# EAGLE design TSC8-75pld (EAGLE 6.6.0)
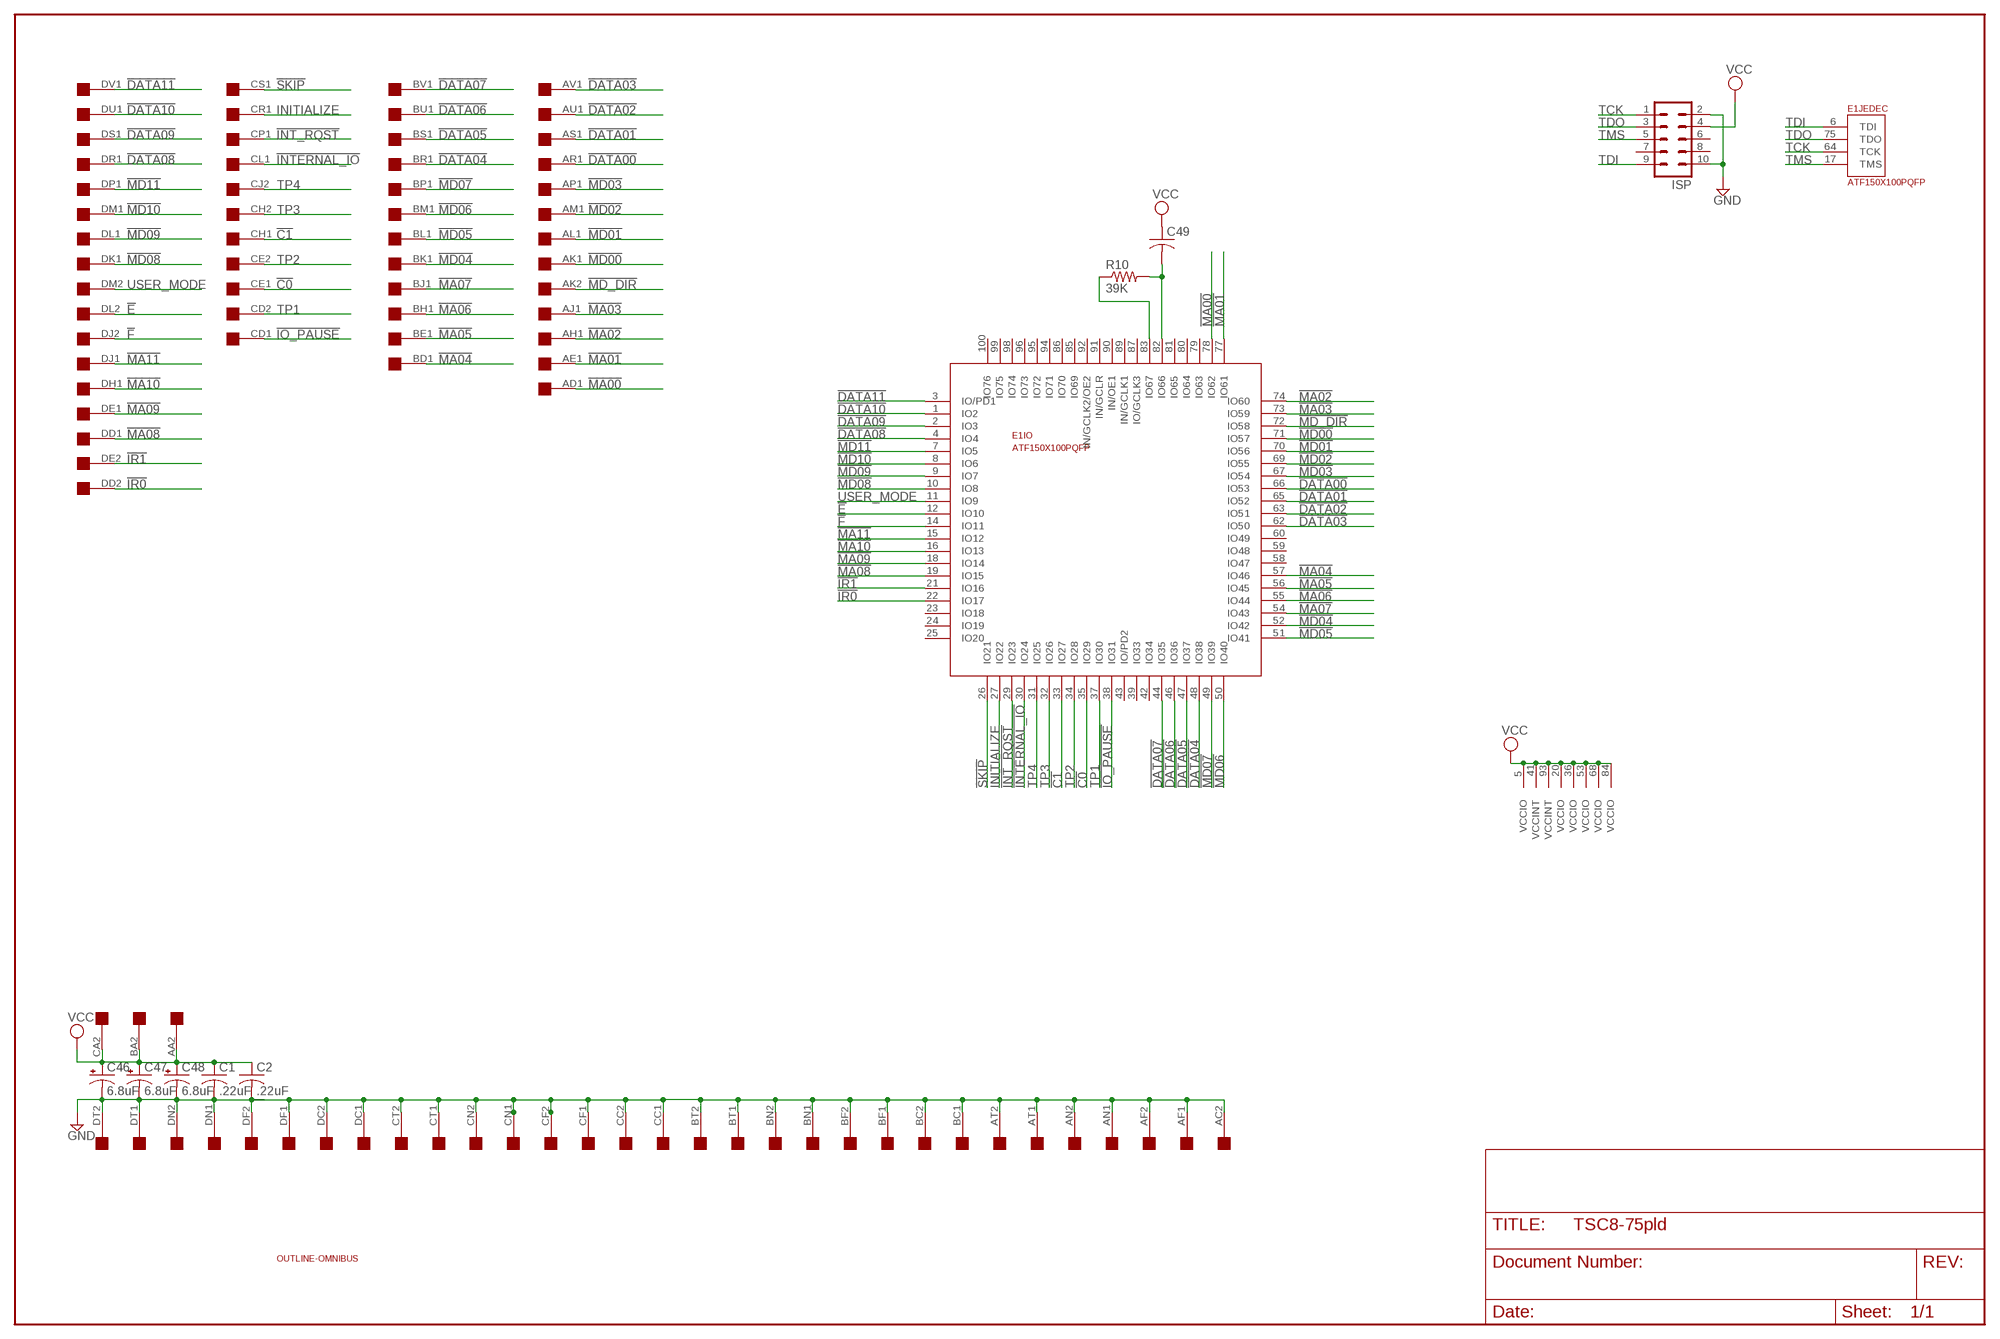
[diagram p0: schematic, sheet 1]

## Parts
C1  .22uF  C-US050-025X075  [C050-025X075]
C2  .22uF  C-US050-025X075  [C050-025X075]
C46  6.8uF  CPOL-USE20-8AXIAL  [E12-8]
C47  6.8uF  CPOL-USE20-8AXIAL  [E12-8]
C48  6.8uF  CPOL-USE20-8AXIAL  [E12-8]
C49  C-US050-025X075  [C050-025X075]
E1  ATF150X100PQFP  [PQFP-100]
EDGE  QUAD  [EDGE-CON8]
ISP  ML10  [ML10]
R10  39K  R-US_0204/7  [0204/7]
U$1  OUTLINE-OMNIBUS  [OMNIBUS]

## Nets
!C0: E1.35(IO:IO29) EDGE.CE1
!C1: E1.33(IO:IO27) EDGE.CH1
!DATA00: E1.66(IO:IO53) EDGE.AR1
!DATA01: E1.65(IO:IO52) EDGE.AS1
!DATA02: E1.63(IO:IO51) EDGE.AU1
!DATA03: E1.62(IO:IO50) EDGE.AV1
!DATA04: E1.48(IO:IO38) EDGE.BR1
!DATA05: E1.47(IO:IO37) EDGE.BS1
!DATA06: E1.46(IO:IO36) EDGE.BU1
!DATA07: E1.44(IO:IO35) EDGE.BV1
!DATA08: E1.4(IO:IO4) EDGE.DR1
!DATA09: E1.2(IO:IO3) EDGE.DS1
!DATA10: E1.1(IO:IO2) EDGE.DU1
!DATA11: E1.3(IO:IO/PD1) EDGE.DV1
!E: E1.12(IO:IO10) EDGE.DL2
!F: E1.14(IO:IO11) EDGE.DJ2
!INT_RQST: E1.29(IO:IO23) EDGE.CP1
!INTERNAL_IO: E1.30(IO:IO24) EDGE.CL1
!IO_PAUSE: E1.38(IO:IO31) EDGE.CD1
!IR0: E1.22(IO:IO17) EDGE.DD2
!IR1: E1.21(IO:IO16) EDGE.DE2
!MA00: E1.78(IO:IO62) EDGE.AD1
!MA01: E1.77(IO:IO61) EDGE.AE1
!MA02: E1.74(IO:IO60) EDGE.AH1
!MA03: E1.73(IO:IO59) EDGE.AJ1
!MA04: E1.57(IO:IO46) EDGE.BD1
!MA05: E1.56(IO:IO45) EDGE.BE1
!MA06: E1.55(IO:IO44) EDGE.BH1
!MA07: E1.54(IO:IO43) EDGE.BJ1
!MA08: E1.19(IO:IO15) EDGE.DD1
!MA09: E1.18(IO:IO14) EDGE.DE1
!MA10: E1.16(IO:IO13) EDGE.DH1
!MA11: E1.15(IO:IO12) EDGE.DJ1
!MD00: E1.71(IO:IO57) EDGE.AK1
!MD01: E1.70(IO:IO56) EDGE.AL1
!MD02: E1.69(IO:IO55) EDGE.AM1
!MD03: E1.67(IO:IO54) EDGE.AP1
!MD04: E1.52(IO:IO42) EDGE.BK1
!MD05: E1.51(IO:IO41) EDGE.BL1
!MD06: E1.50(IO:IO40) EDGE.BM1
!MD07: E1.49(IO:IO39) EDGE.BP1
!MD08: E1.10(IO:IO8) EDGE.DK1
!MD09: E1.9(IO:IO7) EDGE.DL1
!MD10: E1.8(IO:IO6) EDGE.DM1
!MD11: E1.7(IO:IO5) EDGE.DP1
!MD_DIR: E1.72(IO:IO58) EDGE.AK2
!SKIP: E1.26(IO:IO21) EDGE.CS1
GND: C1.2 C2.2 C46.- C47.- C48.- EDGE.AC2 EDGE.AF1 EDGE.AF2 EDGE.AN1 EDGE.AN2 EDGE.AT1 EDGE.AT2 EDGE.BC1 EDGE.BC2 EDGE.BF1 EDGE.BF2 EDGE.BN1 EDGE.BN2 EDGE.BT1 EDGE.BT2 EDGE.CC1 EDGE.CC2 EDGE.CF1 EDGE.CF2 EDGE.CN1 EDGE.CN2 EDGE.CT1 EDGE.CT2 EDGE.DC1 EDGE.DC2 EDGE.DF1 EDGE.DF2 EDGE.DN1 EDGE.DN2 EDGE.DT1 EDGE.DT2 ISP.2 ISP.10
INITIALIZE: E1.27(IO:IO22) EDGE.CR1
N$63: E1.83(IO:IO67) R10.1
N$558: C49.2 E1.82(IO:IO66) R10.2
TCK: E1.64(JEDEC:TCK) ISP.1
TDI: E1.6(JEDEC:TDI) ISP.9
TDO: E1.75(JEDEC:TDO) ISP.3
TMS: E1.17(JEDEC:TMS) ISP.5
TP1: E1.37(IO:IO30) EDGE.CD2
TP2: E1.34(IO:IO28) EDGE.CE2
TP3: E1.32(IO:IO26) EDGE.CH2
TP4: E1.31(IO:IO25) EDGE.CJ2
USER_MODE: E1.11(IO:IO9) EDGE.DM2
VCC: C1.1 C2.1 C46.+ C47.+ C48.+ C49.1 E1.5(VCCIO) E1.20(VCCIO) E1.36(VCCIO) E1.41(VCCINT) E1.53(VCCIO) E1.68(VCCIO) E1.84(VCCIO) E1.93(VCCINT) EDGE.AA2 EDGE.BA2 EDGE.CA2 ISP.4
Unconnected: E1.23(IO:IO18) E1.24(IO:IO19) E1.25(IO:IO20) E1.39(IO:IO33) E1.42(IO:IO34) E1.43(IO:IO/PD2) E1.58(IO:IO47) E1.59(IO:IO48) E1.60(IO:IO49) E1.79(IO:IO63) E1.80(IO:IO64) E1.81(IO:IO65) E1.85(IO:IO69) E1.86(IO:IO70) E1.87(IO:IO/GCLK3) E1.89(IO:IN/GCLK1) E1.90(IO:IN/OE1) E1.91(IO:IN/GCLR) E1.92(IO:IN/GCLK2/OE2) E1.94(IO:IO71) E1.95(IO:IO72) E1.96(IO:IO73) E1.98(IO:IO74) E1.99(IO:IO75) E1.100(IO:IO76) EDGE.AA1 EDGE.AB1 EDGE.AB2 EDGE.AC1 EDGE.AD2 EDGE.AE2 EDGE.AH2 EDGE.AJ2 EDGE.AL2 EDGE.AM2 EDGE.AP2 EDGE.AR2 EDGE.AS2 EDGE.AU2 EDGE.AV2 EDGE.BA1 EDGE.BB1 EDGE.BB2 EDGE.BD2 EDGE.BE2 EDGE.BH2 EDGE.BJ2 EDGE.BK2 EDGE.BL2 EDGE.BM2 EDGE.BP2 EDGE.BR2 EDGE.BS2 EDGE.BU2 EDGE.BV2 EDGE.CA1 EDGE.CB1 EDGE.CB2 EDGE.CJ1 EDGE.CK1 EDGE.CK2 EDGE.CL2 EDGE.CM1 EDGE.CM2 EDGE.CP2 EDGE.CR2 EDGE.CS2 EDGE.CU1 EDGE.CU2 EDGE.CV1 EDGE.CV2 EDGE.DA1 EDGE.DA2 EDGE.DB1 EDGE.DB2 EDGE.DH2 EDGE.DK2 EDGE.DP2 EDGE.DR2 EDGE.DS2 EDGE.DU2 EDGE.DV2 ISP.6 ISP.7 ISP.8

## Power pins joined to a net without a drawn wire
GND: E1.13(GND) E1.28(GND) E1.40(GND) E1.45(GND) E1.61(GND) E1.76(GND) E1.88(GND) E1.97(GND)

## Library data of the parts
C1 C2 C49 = rcl:C-US: CAPACITOR, American symbol
C46-C48 = dec-con:CPOL-USE20-8AXIAL: A 0.8 inch electrolytic.
E1 = atmel-cpld:ATF150X100: ATF150x in 100 pin package.
EDGE = dec-con:QUAD: Quad-Height DEC board
ISP = con-harting-ml:ML10: HARTING
R10 = rcl:R-US_: RESISTOR, American symbol
U$1 = dec-con:OUTLINE-*: Board outlines for DEC boards.

## Net classes
0 default: width 0.305 mm

## Board
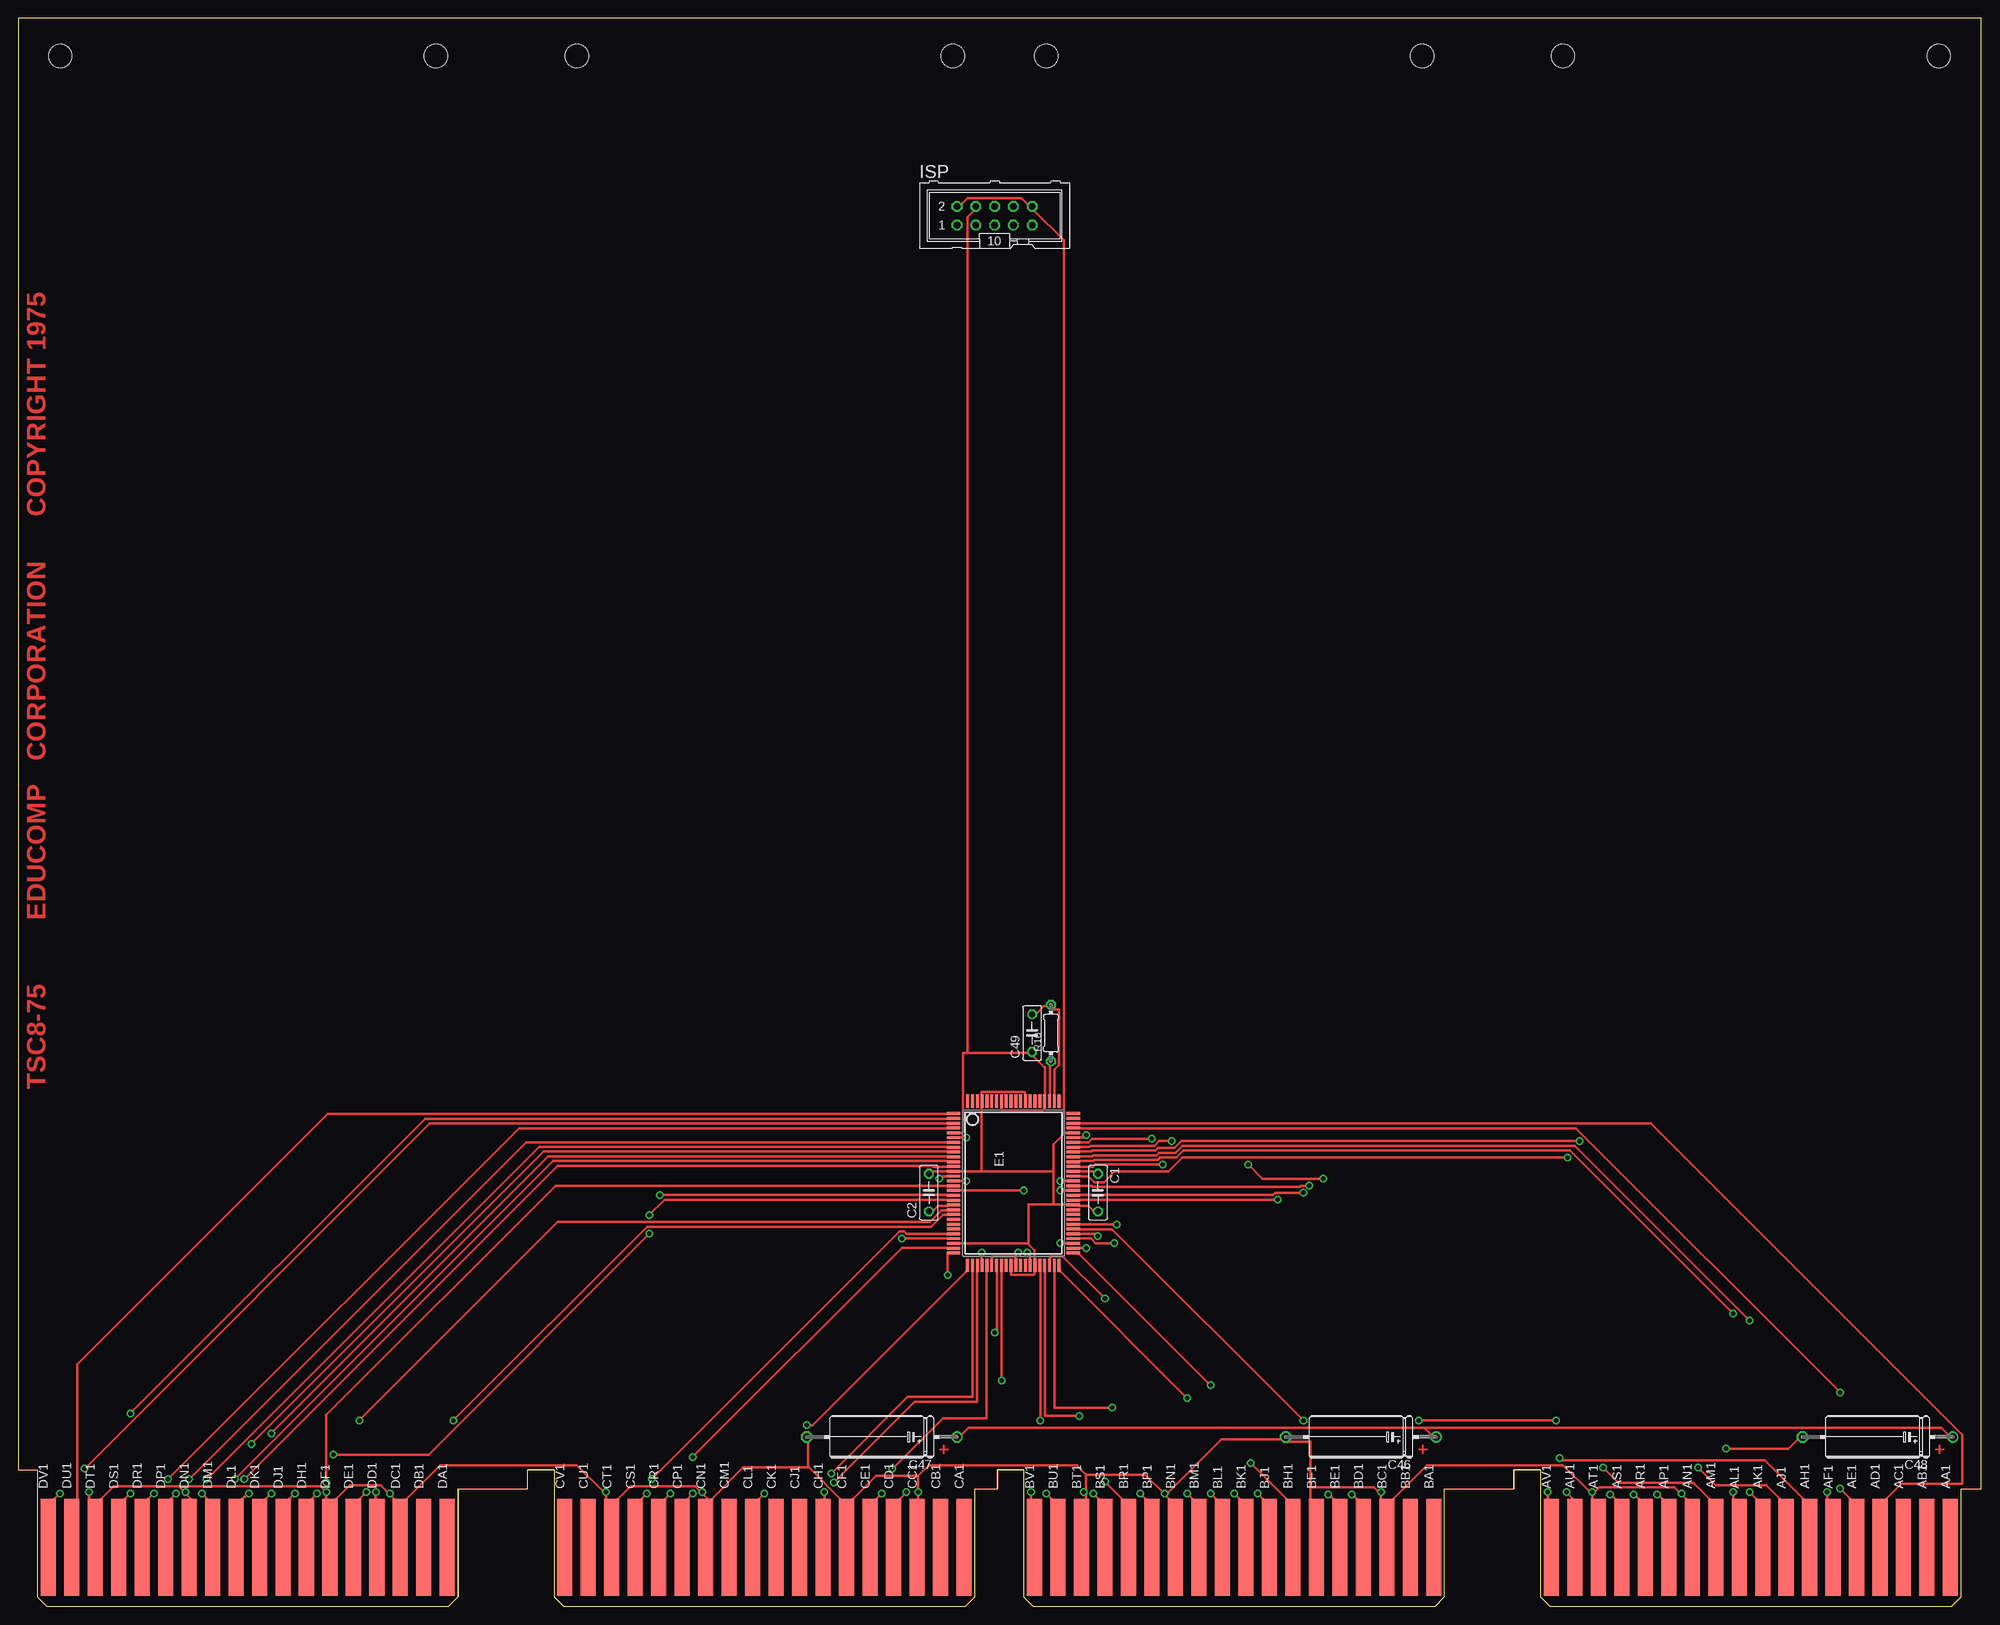
[diagram p1: board, top side]
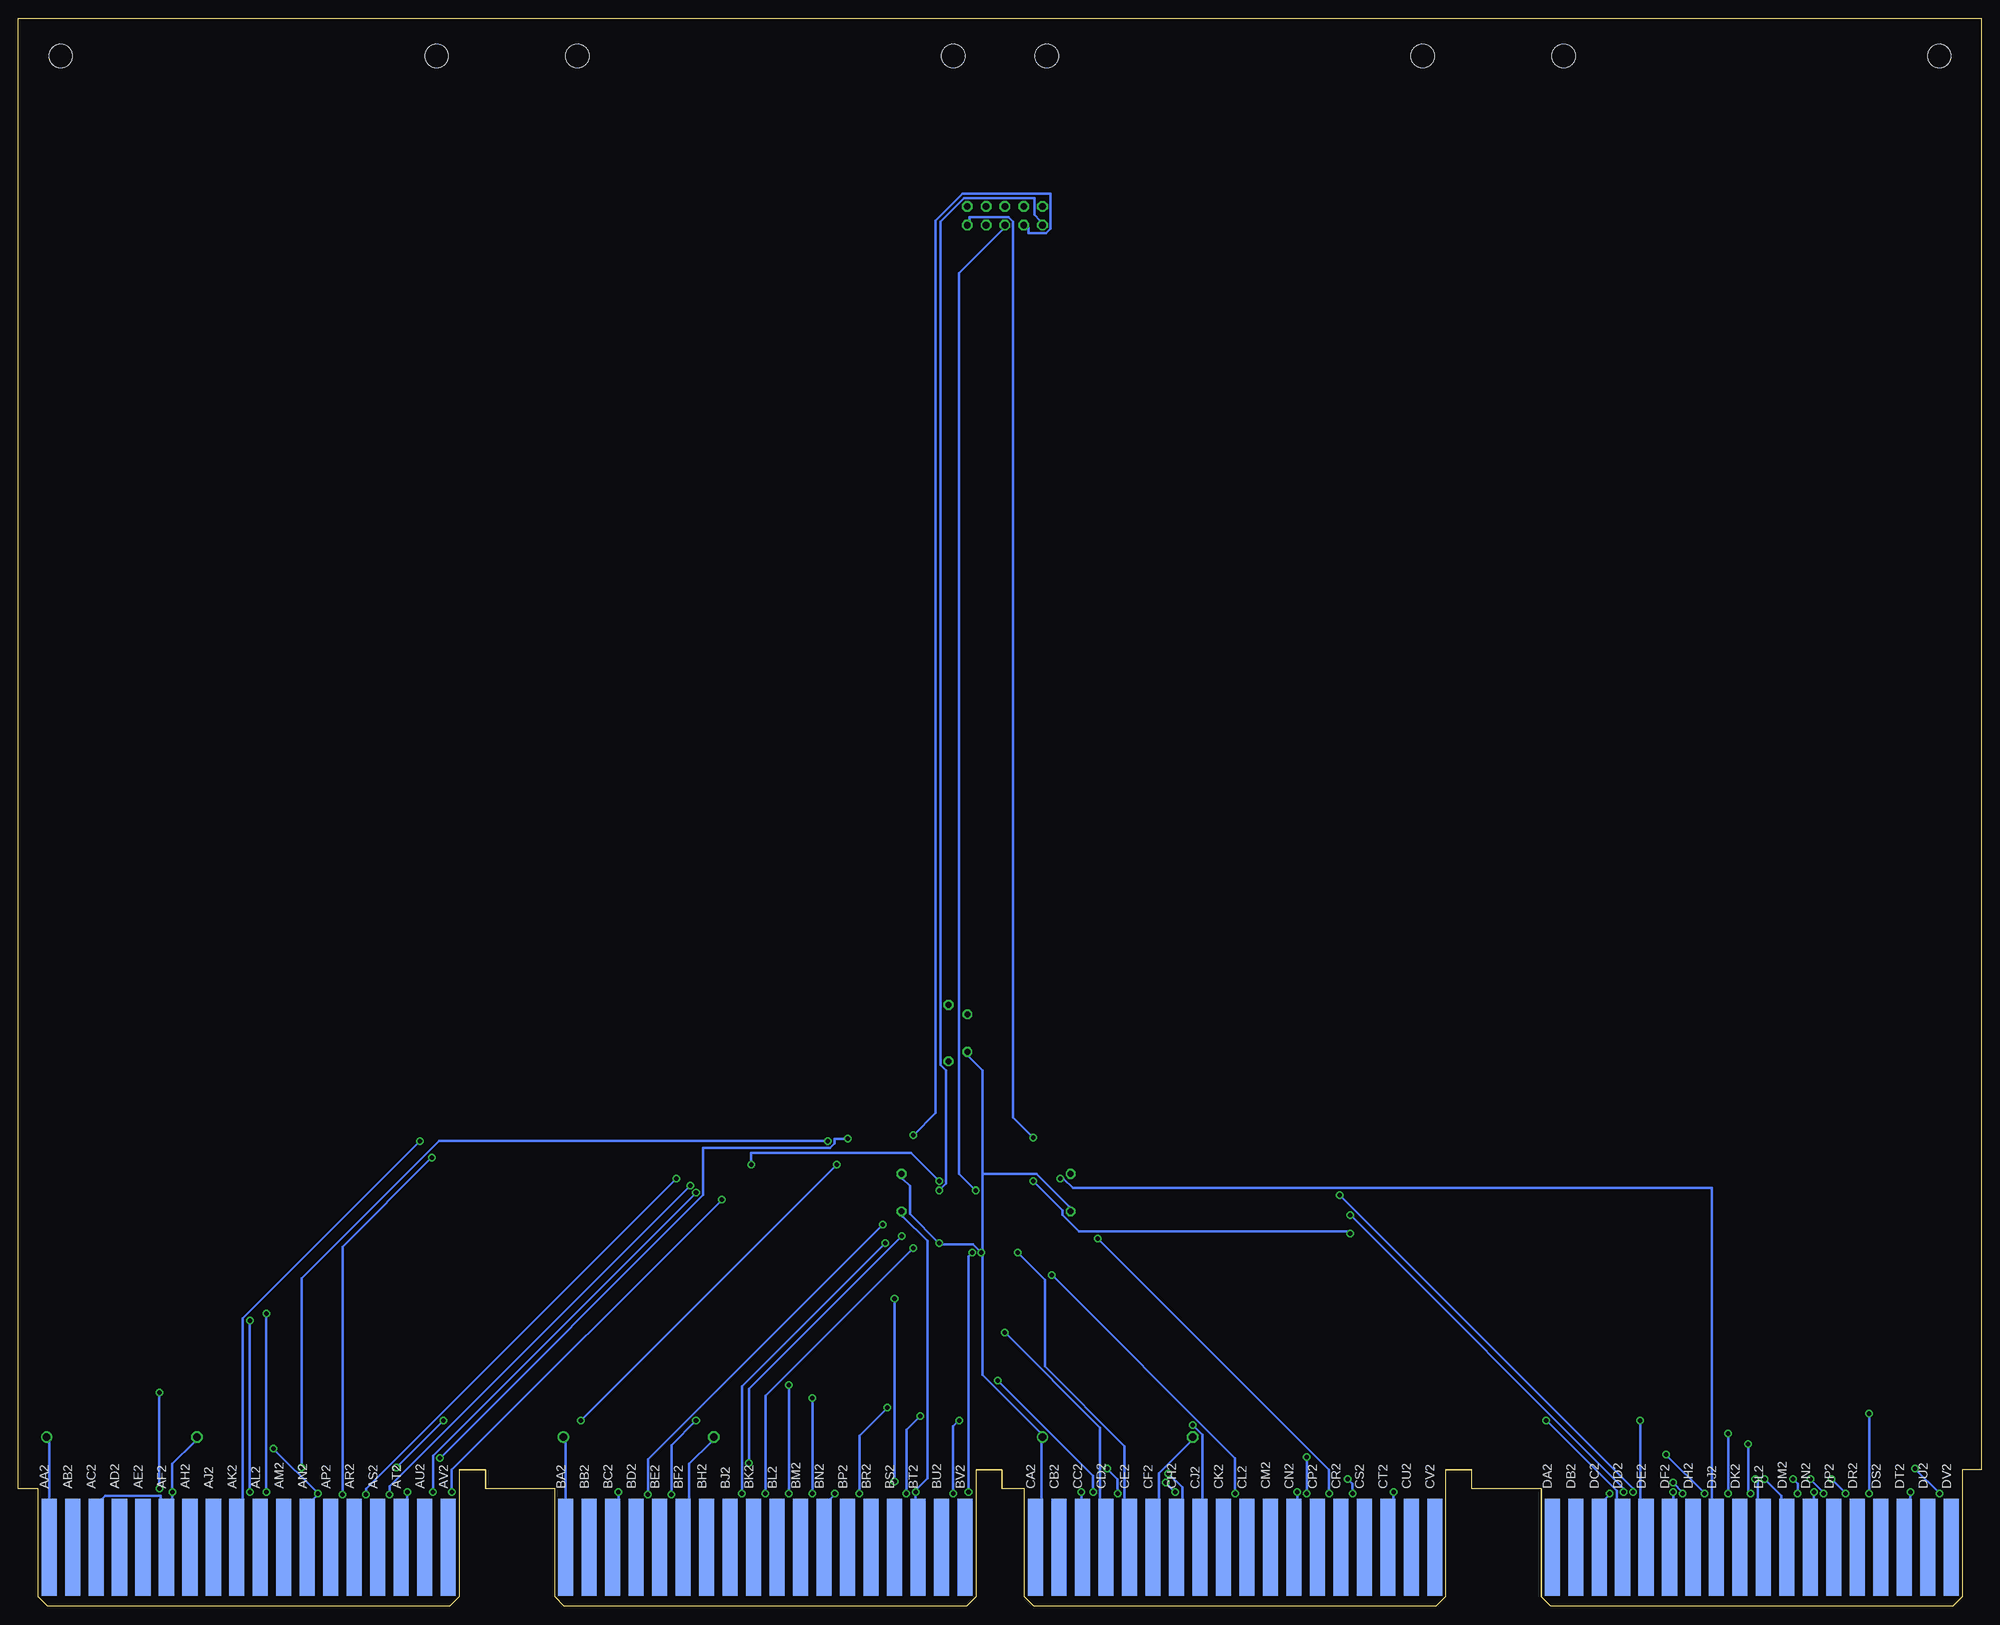
[diagram p2: board, bottom side, seen from below]

Size 265.3 x 214.63 mm. Coordinates in mm from the lower left corner, seen from the top.
Copper layers (1*2*15*16): Top 0.035mm / dielectric 1.5mm / Route2 0.035mm / dielectric 0.15mm / Route15 0.035mm / dielectric 0.2mm / Bottom 0.035mm
Design rules "8mils": minimum track width 8mil, minimum drill 24mil, track to track 8mil, track to pad 8mil, pad to pad 8mil, via to via 8mil, smd to smd 8mil, copper to edge 15mil, drill to drill 8mil, minimum pad ring 10mil, minimum via ring 8mil, stop-mask expansion 0mil, vias tented up to drill 0mil, thermal gap 10mil

### Footprints (pad centres in the part's own frame; a part is rotated, then mirrored left to right if it is on the bottom)
C050-025X075 = drill 0.813 octagon: 1 -2.54,0; 2 2.54,0
E12-8 = drill 1.016: + -10.16,0 | drill 1.016 octagon: - 10.16,0
PQFP-100 = smd 0.4 x 1.8: 1 -9.425,-8.1; 2 -8.775,-8.1; 3 -8.125,-8.1; 4 -7.475,-8.1; 5 -6.825,-8.1; 6 -6.175,-8.1; 7 -5.525,-8.1; 8 -4.875,-8.1; 9 -4.225,-8.1; 10 -3.575,-8.1; 11 -2.925,-8.1; 12 -2.275,-8.1; 13 -1.625,-8.1; 14 -0.975,-8.1; 15 -0.325,-8.1; 16 0.325,-8.1; 17 0.975,-8.1; 18 1.625,-8.1; 19 2.275,-8.1; 20 2.925,-8.1; 21 3.575,-8.1; 22 4.225,-8.1; 23 4.875,-8.1; 24 5.525,-8.1; 25 6.175,-8.1; 26 6.825,-8.1; 27 7.475,-8.1; 28 8.125,-8.1; 29 8.775,-8.1; 30 9.425,-8.1; 51 9.425,8.1; 52 8.775,8.1; 53 8.125,8.1; 54 7.475,8.1; 55 6.825,8.1; 56 6.175,8.1; 57 5.525,8.1; 58 4.875,8.1; 59 4.225,8.1; 60 3.575,8.1; 61 2.925,8.1; 62 2.275,8.1; 63 1.625,8.1; 64 0.975,8.1; 65 0.325,8.1; 66 -0.325,8.1; 67 -0.975,8.1; 68 -1.625,8.1; 69 -2.275,8.1; 70 -2.925,8.1; 71 -3.575,8.1; 72 -4.225,8.1; 73 -4.875,8.1; 74 -5.525,8.1; 75 -6.175,8.1; 76 -6.825,8.1; 77 -7.475,8.1; 78 -8.125,8.1; 79 -8.775,8.1; 80 -9.425,8.1 | smd 1.8 x 0.4: 31 11.1,-6.175; 32 11.1,-5.525; 33 11.1,-4.875; 34 11.1,-4.225; 35 11.1,-3.575; 36 11.1,-2.925; 37 11.1,-2.275; 38 11.1,-1.625; 39 11.1,-0.975; 40 11.1,-0.325; 41 11.1,0.325; 42 11.1,0.975; 43 11.1,1.625; 44 11.1,2.275; 45 11.1,2.925; 46 11.1,3.575; 47 11.1,4.225; 48 11.1,4.875; 49 11.1,5.525; 50 11.1,6.175; 81 -11.1,6.175; 82 -11.1,5.525; 83 -11.1,4.875; 84 -11.1,4.225; 85 -11.1,3.575; 86 -11.1,2.925; 87 -11.1,2.275; 88 -11.1,1.625; 89 -11.1,0.975; 90 -11.1,0.325; 91 -11.1,-0.325; 92 -11.1,-0.975; 93 -11.1,-1.625; 94 -11.1,-2.275; 95 -11.1,-2.925; 96 -11.1,-3.575; 97 -11.1,-4.225; 98 -11.1,-4.875; 99 -11.1,-5.525; 100 -11.1,-6.175
EDGE-CON8 = smd 2.032 x 13.106: AA1 261.303,7.938; AB1 258.127,7.938; AC1 254.952,7.938; AD1 251.778,7.938; AE1 248.602,7.938; AF1 245.428,7.938; AH1 242.252,7.938; AJ1 239.077,7.938; AK1 235.903,7.938; AL1 232.727,7.938; AM1 229.553,7.938; AN1 226.377,7.938; AP1 223.202,7.938; AR1 220.028,7.938; AS1 216.852,7.938; AT1 213.678,7.938; AU1 210.502,7.938; AV1 207.327,7.938; BA1 191.452,7.938; BB1 188.278,7.938; BC1 185.102,7.938; BD1 181.928,7.938; BE1 178.752,7.938; BF1 175.577,7.938; BH1 172.403,7.938; BJ1 169.227,7.938; BK1 166.053,7.938; BL1 162.877,7.938; BM1 159.702,7.938; BN1 156.528,7.938; BP1 153.352,7.938; BR1 150.178,7.938; BS1 147.002,7.938; BT1 143.827,7.938; BU1 140.653,7.938; BV1 137.477,7.938; CA1 127.953,7.938; CB1 124.778,7.938; CC1 121.603,7.938; CD1 118.427,7.938; CE1 115.252,7.938; CF1 112.078,7.938; CH1 108.903,7.938; CJ1 105.728,7.938; CK1 102.552,7.938; CL1 99.377,7.938; CM1 96.203,7.938; CN1 93.028,7.938; CP1 89.853,7.938; CR1 86.677,7.938; CS1 83.502,7.938; CT1 80.328,7.938; CU1 77.153,7.938; CV1 73.978,7.938; DA1 58.102,7.938; DB1 54.928,7.938; DC1 51.752,7.938; DD1 48.578,7.938; DE1 45.403,7.938; DF1 42.227,7.938; DH1 39.053,7.938; DJ1 35.877,7.938; DK1 32.703,7.938; DL1 29.527,7.938; DM1 26.352,7.938; DN1 23.177,7.938; DP1 20.003,7.938; DR1 16.828,7.938; DS1 13.652,7.938; DT1 10.477,7.938; DU1 7.303,7.938; DV1 4.128,7.938 | smd 2.032 x 13.106 bottom: AA2 261.303,7.938; AB2 258.127,7.938; AC2 254.952,7.938; AD2 251.778,7.938; AE2 248.602,7.938; AF2 245.428,7.938; AH2 242.252,7.938; AJ2 239.077,7.938; AK2 235.903,7.938; AL2 232.727,7.938; AM2 229.553,7.938; AN2 226.377,7.938; AP2 223.202,7.938; AR2 220.028,7.938; AS2 216.852,7.938; AT2 213.678,7.938; AU2 210.502,7.938; AV2 207.327,7.938; BA2 191.452,7.938; BB2 188.278,7.938; BC2 185.102,7.938; BD2 181.928,7.938; BE2 178.752,7.938; BF2 175.577,7.938; BH2 172.403,7.938; BJ2 169.227,7.938; BK2 166.053,7.938; BL2 162.877,7.938; BM2 159.702,7.938; BN2 156.528,7.938; BP2 153.352,7.938; BR2 150.178,7.938; BS2 147.002,7.938; BT2 143.827,7.938; BU2 140.653,7.938; BV2 137.477,7.938; CA2 127.953,7.938; CB2 124.778,7.938; CC2 121.603,7.938; CD2 118.427,7.938; CE2 115.252,7.938; CF2 112.078,7.938; CH2 108.903,7.938; CJ2 105.728,7.938; CK2 102.552,7.938; CL2 99.377,7.938; CM2 96.203,7.938; CN2 93.028,7.938; CP2 89.853,7.938; CR2 86.677,7.938; CS2 83.502,7.938; CT2 80.328,7.938; CU2 77.153,7.938; CV2 73.978,7.938; DA2 58.102,7.938; DB2 54.928,7.938; DC2 51.752,7.938; DD2 48.578,7.938; DE2 45.403,7.938; DF2 42.227,7.938; DH2 39.053,7.938; DJ2 35.877,7.938; DK2 32.703,7.938; DL2 29.527,7.938; DM2 26.352,7.938; DN2 23.177,7.938; DP2 20.003,7.938; DR2 16.828,7.938; DS2 13.652,7.938; DT2 10.477,7.938; DU2 7.303,7.938; DV2 4.128,7.938
ML10 = drill 0.914 octagon: 1 -5.08,-1.27; 2 -5.08,1.27; 3 -2.54,-1.27; 4 -2.54,1.27; 5 0,-1.27; 6 0,1.27; 7 2.54,-1.27; 8 2.54,1.27; 9 5.08,-1.27; 10 5.08,1.27
0204/7 = drill 0.813 octagon: 1 -3.81,0; 2 3.81,0
OMNIBUS = hole 3.175: 208.915,209.55; 259.715,209.55; 189.865,209.55; 139.065,209.55; 75.616,209.55; 126.416,209.55; 56.566,209.55; 5.766,209.55

### Placement (x,y rotation side)
C1  145.92,55.88 270 top
C2  123.06,55.88 90 top
C46  181.48,22.86 180 top
C47  116.71,22.86 180 top
C48  251.33,22.86 180 top
C49  137.03,77.47 90 top
E1  134.49,57.15 270 top
EDGE  -0.13,0 0 top
ISP  131.95,187.96 0 top
R10  139.57,77.47 90 top
U$1  -0.13,0 0 top

### Tracks (layer width: path | path; a pad name or v marks a point on that pad's centre or on a via)
!C0  (via drill 0.61)
  Top 0.305: v118.14,18.57 124.97,25.4 130.84,25.4 130.84,45.24 E1.35 | v116.71,15.24 115.92,14.45 EDGE.CE1
  Bottom 0.305: v118.14,18.57 116.71,17.14 v116.71,15.24
!C1  (via drill 0.61)
  Top 0.305: v110.2,16.67 121.16,27.62 129.57,27.62 129.57,45.24 E1.33 | v108.93,15.4 108.93,14.45 EDGE.CH1
  Bottom 0.305: v108.93,15.4 v110.2,16.67
!DATA00  (via drill 0.61)
  Top 0.305: v140.84,57.47 141.8,57.47 E1.66 | v166.24,59.69 168.15,57.78 v176.4,57.78 | v218.31,15.08 218.63,14.76 218.79,14.76 219.11,14.45 EDGE.AR1
  Bottom 0.305: v140.84,57.47 144.65,61.28 166.24,61.28 v166.24,59.69 | v176.4,57.78 218.31,15.88 v218.31,15.08
!DATA01  (via drill 0.61)
  Top 0.305: v174.5,56.83 173.39,56.83 173.23,56.67 145.29,56.67 145.13,56.83 143.38,56.83 E1.65 | v215.14,15.08 215.46,14.76 215.61,14.76 215.93,14.45 EDGE.AS1
  Bottom 0.305: v174.5,56.83 215.14,16.19 v215.14,15.08
!DATA02  (via drill 0.61)
  Top 0.305: v173.7,55.88 169.89,55.88 169.58,55.56 143.38,55.56 E1.63 | v209.26,15.4 210.22,14.45 EDGE.AU1
  Bottom 0.305: v173.7,55.88 209.26,20.32 v209.26,15.4
!DATA03  (via drill 0.61)
  Top 0.305: v170.21,54.93 143.38,54.93 E1.62 | v206.72,15.4 206.72,14.45 EDGE.AV1
  Bottom 0.305: v170.21,54.93 206.72,18.41 v206.72,15.4
!DATA04  (via drill 0.61)
  Top 0.305: v146.88,41.59 141.16,47.31 139.41,47.31 139.41,46.83 E1.48 | v146.88,16.83 149.26,14.45 EDGE.BR1
  Bottom 0.305: v146.88,16.83 v146.88,41.59
!DATA05  (via drill 0.61)
  Top 0.305: v143.38,25.72 138.78,25.72 138.78,45.24 E1.47 | v145.29,15.24 146.08,14.45 EDGE.BS1
  Bottom 0.305: v143.38,25.72 145.29,23.81 v145.29,15.24
!DATA06  (via drill 0.61)
  Top 0.305: v138.14,25.08 138.14,45.24 E1.46 | v138.94,15.24 139.73,14.45 EDGE.BU1
  Bottom 0.305: v138.14,25.08 138.94,24.29 v138.94,15.24
!DATA07  (via drill 0.61)
  Top 0.305: v136.4,47.78 136.72,47.78 136.72,46.83 E1.44 | v136.87,15.4 136.87,14.45 EDGE.BV1
  Bottom 0.305: v136.4,47.78 136.87,47.31 v136.87,15.4
!DATA08  (via drill 0.61)
  Top 0.305: v20.19,17.14 67.66,64.61 125.6,64.61 E1.4 | v18.29,15.24 17.49,14.45 EDGE.DR1
  Bottom 0.305: v18.29,15.24 v20.19,17.14
!DATA09  (via drill 0.61)
  Top 0.305: v15.11,26.04 54.96,65.88 125.6,65.88 E1.2 | v15.11,15.24 14.32,14.45 EDGE.DS1
  Bottom 0.305: v15.11,15.24 v15.11,26.04
!DATA10
  Top 0.305: E1.1 125.6,66.52 41.78,66.52 7.97,32.7 7.97,14.45 EDGE.DU1
!DATA11  (via drill 0.61)
  Top 0.305: v8.92,18.57 55.59,65.25 125.6,65.25 E1.3 | v5.59,15.24 4.79,14.45 EDGE.DV1
  Bottom 0.305: v5.59,15.24 v8.92,18.57
!E  (via drill 0.61)
  Top 0.305: v30.51,17.14 72.9,59.53 123.54,59.53 123.7,59.37 125.6,59.37 E1.12
  Bottom 0.305: v30.51,17.14 30.19,16.83 30.19,14.45 EDGE.DL2
!F  (via drill 0.61)
  Top 0.305: v124.49,57.78 124.81,58.1 125.6,58.1 E1.14
  Bottom 0.305: v124.49,57.78 124.02,57.78 122.75,56.52 36.39,56.52 36.39,14.45 EDGE.DJ2
!INT_RQST  (via drill 0.61)
  Top 0.305: v91.15,20.16 119.41,48.42 125.6,48.42 E1.29 | v91.15,15.24 90.36,14.45 EDGE.CP1
  Bottom 0.305: v91.15,15.24 v91.15,20.16
!INTERNAL_IO  (via drill 0.61)
  Top 0.305: v125.6,44.77 125.6,47.62 E1.30 | v100.84,15.24 100.04,14.45 EDGE.CL1
  Bottom 0.305: v125.6,44.77 100.84,20 v100.84,15.24
!IO_PAUSE  (via drill 0.61)
  Top 0.305: v132.91,30.48 132.91,45.24 E1.38 | v120.05,15.4 119.09,14.45 EDGE.CD1
  Bottom 0.305: v132.91,30.48 120.05,17.62 v120.05,15.4
!IR0  (via drill 0.61)
  Top 0.305: v58.77,25.08 84.96,51.28 123.38,51.28 124.97,52.86 125.6,52.86 E1.22
  Bottom 0.305: v58.77,25.08 49.24,15.56 49.24,14.45 EDGE.DD2
!IR1  (via drill 0.61)
  Top 0.305: v46.07,25.08 72.9,51.91 123.22,51.91 124.81,53.5 125.6,53.5 E1.21
  Bottom 0.305: v46.07,25.08 46.07,14.45 EDGE.DE2
!MA00
  Top 0.305: E1.78 143.38,65.25 220.69,65.25 262.76,23.18 262.76,16.51 254.51,16.51 252.44,14.45 EDGE.AD1
!MA01  (via drill 0.61)
  Top 0.305: v246.25,28.89 210.53,64.61 143.38,64.61 E1.77 | v246.25,15.88 247.68,14.45 EDGE.AE1
  Bottom 0.305: v246.25,15.88 v246.25,28.89
!MA02  (via drill 0.61)
  Top 0.305: v153.23,63.18 145.13,63.18 144.65,62.71 143.38,62.71 E1.74 | v208.31,20 208.63,19.68 236.09,19.68 241.33,14.45 EDGE.AH1
  Bottom 0.305: v153.23,63.18 154.97,63.18 154.97,62.55 155.61,61.91 172.75,61.91 172.75,55.56 v208.31,20
!MA03  (via drill 0.61)
  Top 0.305: v155.92,62.87 154.18,62.87 153.54,62.23 144.97,62.23 144.81,62.07 143.38,62.07 E1.73 | v227.04,18.73 229.43,16.35 236.25,16.35 238.16,14.45 EDGE.AJ1
  Bottom 0.305: v155.92,62.87 208.47,62.87 227.04,44.29 v227.04,18.73
!MA04  (via drill 0.61)
  Top 0.305: v148.46,51.59 143.38,51.59 E1.57 | v180.21,15.08 180.53,14.76 180.69,14.76 181.01,14.45 EDGE.BD1
  Bottom 0.305: v148.46,51.59 180.21,19.84 v180.21,15.08
!MA05  (via drill 0.61)
  Top 0.305: v173.7,25.08 147.83,50.96 143.38,50.96 E1.56 | v177.04,15.08 177.36,14.76 177.51,14.76 177.83,14.45 EDGE.BE1
  Bottom 0.305: v173.7,25.08 177.04,21.75 v177.04,15.08
!MA06  (via drill 0.61)
  Top 0.305: v145.92,50.01 145.61,50.32 143.38,50.32 E1.55 | v166.56,19.37 171.48,14.45 EDGE.BH1
  Bottom 0.305: v145.92,50.01 166.56,29.37 v166.56,19.37
!MA07  (via drill 0.61)
  Top 0.305: v148.15,49.05 145.61,49.05 144.97,49.69 143.38,49.69 E1.54 | v167.51,15.24 168.31,14.45 EDGE.BJ1
  Bottom 0.305: v148.15,49.05 167.51,29.69 v167.51,15.24
!MA08  (via drill 0.61)
  Top 0.305: v85.28,52.86 87.34,54.93 125.6,54.93 E1.19 | v48.29,15.4 48.29,14.45 EDGE.DD1
  Bottom 0.305: v85.28,52.86 48.29,15.88 v48.29,15.4
!MA09  (via drill 0.61)
  Top 0.305: v86.71,55.56 125.6,55.56 E1.18 | v47.02,15.4 46.07,14.45 EDGE.DE1
  Bottom 0.305: v86.71,55.56 47.02,15.88 v47.02,15.4
!MA10  (via drill 0.61)
  Top 0.305: v41.62,16.67 41.62,25.88 72.58,56.83 125.6,56.83 E1.16 | v40.35,15.24 39.56,14.45 EDGE.DH1
  Bottom 0.305: v41.62,16.67 40.35,15.4 v40.35,15.24
!MA11  (via drill 0.61)
  Top 0.305: v128.14,57.47 127.19,57.47 E1.15 | v85.28,50.32 55.44,20.48 v42.58,20.48 | v37.34,15.24 36.54,14.45 EDGE.DJ1
  Bottom 0.305: v128.14,57.47 124.17,53.5 124.17,52.86 121.95,50.64 85.28,50.64 v85.28,50.32 | v37.34,15.24 v42.58,20.48
!MD00  (via drill 0.61)
  Top 0.305: v234.03,38.58 210.38,62.23 157.35,62.23 156.4,61.28 154.18,61.28 153.86,60.96 145.29,60.96 145.13,60.8 143.38,60.8 E1.71 | v234.03,15.4 234.98,14.45 EDGE.AK1
  Bottom 0.305: v234.03,38.58 v234.03,15.4
!MD01  (via drill 0.61)
  Top 0.305: v231.81,39.53 209.74,61.59 157.51,61.59 156.56,60.64 154.34,60.64 154.02,60.33 145.45,60.33 145.29,60.17 143.38,60.17 E1.70 | v231.81,15.4 231.81,14.45 EDGE.AL1
  Bottom 0.305: v231.81,39.53 v231.81,15.4
!MD02  (via drill 0.61)
  Top 0.305: v154.65,59.69 145.61,59.69 145.29,59.37 143.38,59.37 E1.69 | v189.26,25.08 v207.84,25.08 | v214.19,18.73 216.25,16.67 226.41,16.67 228.63,14.45 EDGE.AM1
  Bottom 0.305: v154.65,59.69 v189.26,25.08 | v207.84,25.08 v214.19,18.73
!MD03  (via drill 0.61)
  Top 0.305: v209.42,60.64 157.35,60.64 155.45,58.74 148.15,58.74 146.72,57.31 145.45,57.31 144.65,58.1 143.38,58.1 E1.67 | v221.49,15.08 221.81,14.76 221.96,14.76 222.28,14.45 EDGE.AP1
  Bottom 0.305: v209.42,60.64 221.49,48.58 v221.49,15.08
!MD04  (via drill 0.61)
  Top 0.305: v144.34,48.42 143.38,48.42 E1.52 | v164.34,15.24 165.13,14.45 EDGE.BK1
  Bottom 0.305: v144.34,48.42 164.34,28.42 v164.34,15.24
!MD05  (via drill 0.61)
  Top 0.305: v161.16,29.84 143.38,47.62 E1.51 | v161.16,15.24 161.96,14.45 EDGE.BL1
  Bottom 0.305: v161.16,15.24 v161.16,29.84
!MD06  (via drill 0.61)
  Top 0.305: v157.99,28.1 140.84,45.24 E1.50 | v157.99,15.24 158.78,14.45 EDGE.BM1
  Bottom 0.305: v157.99,15.24 v157.99,28.1
!MD07  (via drill 0.61)
  Top 0.305: v147.83,26.83 140.05,26.83 140.05,45.24 E1.49 | v151.64,15.24 152.43,14.45 EDGE.BP1
  Bottom 0.305: v147.83,26.83 151.64,23.02 v151.64,15.24
!MD08  (via drill 0.61)
  Top 0.305: v34.16,23.34 71.63,60.8 125.6,60.8 E1.10 | v34.16,15.24 33.37,14.45 EDGE.DK1
  Bottom 0.305: v34.16,15.24 v34.16,23.34
!MD09  (via drill 0.61)
  Top 0.305: v31.46,21.91 70.99,61.44 125.6,61.44 E1.9 | v31.15,15.24 30.67,14.76 30.51,14.76 30.19,14.45 EDGE.DL1
  Bottom 0.305: v31.46,21.91 31.46,15.56 v31.15,15.24
!MD10  (via drill 0.61)
  Top 0.305: v25.43,17.14 70.36,62.07 125.6,62.07 E1.8 | v24.8,15.24 25.59,14.45 EDGE.DM1
  Bottom 0.305: v25.43,17.14 24.8,16.51 v24.8,15.24
!MD11  (via drill 0.61)
  Top 0.305: v23.05,17.14 68.61,62.71 125.6,62.71 E1.7 | v21.3,15.24 20.51,14.45 EDGE.DP1
  Bottom 0.305: v23.05,17.14 21.3,15.4 v21.3,15.24
!MD_DIR  (via drill 0.61)
  Top 0.305: v211.01,62.87 157.19,62.87 156.24,61.91 154.02,61.91 153.7,61.59 145.13,61.59 144.97,61.44 143.38,61.44 E1.72
  Bottom 0.305: v211.01,62.87 234.98,38.89 234.98,14.45 EDGE.AK2
!SKIP  (via drill 0.61)
  Top 0.305: v85.6,17.14 119.09,50.64 119.73,50.64 120.05,50.32 125.6,50.32 E1.26 | v84.96,15.24 84.17,14.45 EDGE.CS1
  Bottom 0.305: v85.6,17.14 84.96,16.51 v84.96,15.24
GND  (via drill 0.61)
  Top 0.305: 50.12,15.16 50.83,14.45 EDGE.DC2 52.42,14.45 57.02,19.05 75.44,19.05 78.93,15.56 v79.41,15.4 79.41,14.45 EDGE.CT1 80.99,14.45 82.74,16.19 91.47,16.19 92.34,15.32 | 50.12,15.16 48.93,16.35 44.8,16.35 42.89,14.45 EDGE.DF2 41.62,14.45 v41.62,15.4 40.83,16.19 21.78,16.19 21.7,16.11 | 50.12,15.16 v50.2,15.24 | v9.56,15.4 9.56,14.45 EDGE.DT2 11.14,14.45 12.89,16.19 21.62,16.19 21.7,16.11 | 22.5,15.32 23.37,14.45 EDGE.DN1 | 21.7,16.11 22.5,15.32 | 22.5,15.32 v22.57,15.4 | 92.34,15.32 93.22,14.45 EDGE.CN1 93.69,14.45 97.98,18.73 106.71,18.73 106.79,18.81 | 92.34,15.32 v92.42,15.4 | 106.79,18.81 106.71,18.89 106.71,22.23 C47.- | 106.79,18.81 111.16,14.45 EDGE.CF1 112.74,14.45 115.92,17.62 121.63,17.62 | 121.63,17.62 v121.63,15.4 121.63,14.45 EDGE.CC1 | E1.40 134.18,45.24 134.18,44.77 137.19,44.77 137.35,44.93 137.35,45.24 E1.45 137.35,46.83 137.35,48.1 136.48,48.97 | 136.48,48.97 136.4,49.05 127.19,49.05 E1.28 | E1.88 136.08,69.06 136.08,69.37 135.92,69.53 130.21,69.53 130.21,69.06 E1.97 130.21,67.47 130.21,58.74 | C2.2 123.54,58.74 125.6,58.74 E1.13 127.19,58.74 130.21,58.74 | C1.2 145.29,53.5 144.65,54.13 143.38,54.13 E1.61 141.8,54.29 139.89,54.29 | 141.4,63.9 139.89,62.39 139.89,58.74 | 141.4,63.9 141.48,63.98 141.8,63.98 E1.76 | 139.89,54.29 139.89,58.74 | 139.89,58.74 130.21,58.74 | 139.89,54.29 136.56,54.29 136.56,49.05 136.48,48.97 | 144.34,17.78 144.34,15.4 | 144.34,15.4 144.34,14.45 EDGE.BT1 | 144.34,17.78 152.27,17.78 154.89,15.16 | 154.89,15.16 155.61,14.45 EDGE.BN2 | 144.34,15.4 v144.02,15.4 | 154.89,15.16 v154.97,15.24 155.45,15.4 162.59,22.54 170.69,22.54 C46.- 171.64,22.23 174.66,22.23 174.66,16.03
  Top 0.305: v244.51,15.4 244.51,14.45 EDGE.AF2 | v212.76,15.4 212.76,14.45 EDGE.AT2 | 224.74,15.16 225.46,14.45 EDGE.AN2 | 224.74,15.16 223.87,16.03 213.71,16.03 213.23,15.56 v212.76,15.4 | v224.82,15.24 224.74,15.16 | 174.66,16.03 174.66,14.45 EDGE.BF2 | 174.66,16.03 183.23,16.03 183.71,15.56 v184.18,15.4 184.18,14.45 EDGE.BC1 185.77,14.45 190.37,19.05 208.79,19.05 212.28,15.56 v212.76,15.4 | v230.85,21.27 239.27,21.27 240.54,22.54 C48.- | 121.63,17.62 123.06,19.05 143.07,19.05 144.34,17.78 | ISP.2 127.51,189.55 128.3,190.34 135.6,190.34 136.4,189.55 ISP.10 137.35,188.59 141.32,184.63 141.32,63.98 141.4,63.9
  Bottom 0.305: v41.62,15.4 41.62,14.45 EDGE.DF2 | v50.2,15.24 50.2,15.08 50.83,14.45 EDGE.DC2 | v9.56,15.4 9.56,14.45 EDGE.DT2 | v22.57,15.4 22.57,14.45 EDGE.DN1 | v79.41,15.4 79.41,14.45 EDGE.CT1 | v92.42,15.4 92.42,14.45 EDGE.CN1 | C47.- 106.87,22.23 111.16,17.94 111.16,14.45 EDGE.CF1 | v121.63,15.4 121.63,14.45 EDGE.CC1 | EDGE.BT1 144.02,14.45 v144.02,15.4 143.86,15.88 142.43,17.3 142.43,49.37 145.76,52.7 C1.2 | v154.97,15.24 154.97,15.08 155.61,14.45 EDGE.BN2 | C48.- 241.49,22.23 244.51,19.21 v244.51,15.4 244.51,14.45 EDGE.AF2 246.09,14.45 246.09,14.92 253.56,14.92 254.03,14.45 EDGE.AC2 | v212.76,15.4 212.76,14.45 EDGE.AT2 | EDGE.AN2 225.46,14.45 224.82,15.08 v224.82,15.24 v230.85,21.27 | v184.18,15.4 184.18,14.45 EDGE.BC1 | C46.- 171.64,22.23 174.66,19.21 174.66,14.45 EDGE.BF2
INITIALIZE  (via drill 0.61)
  Top 0.305: v119.41,49.69 125.6,49.69 E1.27 | v88.14,15.24 87.34,14.45 EDGE.CR1
  Bottom 0.305: v119.41,49.69 88.14,18.41 v88.14,15.24
N$63
  Top 0.305: E1.83 139.41,69.06 139.41,73.03 R10.1
N$558
  Top 0.305: E1.82 140.05,69.06 140.05,72.55 140.68,73.18 140.68,80.64 139.73,80.64 R10.2 138.94,81.12 138.62,81.12 137.67,80.17 C49.2
TCK  (via drill 0.61)
  Top 0.305: v140.84,56.2 141.8,56.2 E1.64
  Bottom 0.305: v140.84,56.2 139.89,57.15 139.89,72.39 140.68,73.18 140.68,187.17 137.51,190.34 127.98,190.34 127.98,188.12 127.19,187.32 ISP.1
TDI  (via drill 0.61)
  Top 0.305: v128.14,63.34 127.19,63.34 E1.6
  Bottom 0.305: v128.14,63.34 130.84,66.04 130.84,187.17 131.48,187.8 136.72,187.8 136.72,187.32 ISP.9
TDO  (via drill 0.61)
  Top 0.305: v144.34,63.66 144.02,63.34 143.38,63.34 E1.75
  Bottom 0.305: v144.34,63.66 141.32,66.67 141.32,187.32 137.67,190.98 125.76,190.98 125.76,186.21 126.4,185.58 128.78,185.58 128.78,186.37 ISP.3
TMS  (via drill 0.61)
  Top 0.305: v135.92,56.2 127.19,56.2 E1.17
  Bottom 0.305: v135.92,56.2 138.14,58.42 138.14,180.18 132.27,186.06 ISP.5
TP1  (via drill 0.61)
  Top 0.305: v131.95,36.99 132.27,36.99 132.27,45.24 E1.37
  Bottom 0.305: v131.95,36.99 119.09,24.13 119.09,14.45 EDGE.CD2
TP2  (via drill 0.61)
  Top 0.305: v130.21,47.78 130.21,46.83 E1.34
  Bottom 0.305: v130.21,47.78 126.56,44.13 126.56,32.38 115.76,21.59 115.76,14.45 EDGE.CE2
TP3  (via drill 0.61)
  Top 0.305: v109.89,17.94 120.21,28.26 128.94,28.26 128.94,45.24 E1.32
  Bottom 0.305: v109.89,17.94 107.98,16.03 107.98,14.45 EDGE.CH2
TP4  (via drill 0.61)
  Top 0.305: v106.55,24.45 107.35,24.45 128.14,45.24 E1.31
  Bottom 0.305: v106.55,24.45 105.28,23.18 105.28,14.45 EDGE.CJ2
USER_MODE  (via drill 0.61)
  Top 0.305: v29.24,17.14 72.26,60.17 125.6,60.17 E1.11
  Bottom 0.305: v29.24,17.14 27.02,14.92 27.02,14.45 EDGE.DM2
VCC  (via drill 0.61)
  Top 0.305: E1.93 132.91,67.47 132.91,66.99 138.46,66.99 138.78,67.31 138.78,67.47 E1.84 138.78,69.06 138.78,72.87 138.62,72.87 137.19,74.3 C49.1 136.4,74.77 128.3,74.77 | 128.3,74.77 127.67,74.77 127.67,64.14 127.51,63.98 127.19,63.98 E1.5 | E1.20 125.6,54.13 124.33,54.13 123.7,53.5 C2.1 | 134.73,47.23 134.81,47.15 134.81,46.83 E1.41 | 134.73,47.23 134.65,47.31 131.64,47.31 131.64,46.83 E1.36 | v140.84,49.05 141.8,49.05 E1.53 | E1.68 143.38,58.74 145.45,58.74 C1.1 | v135.13,47.78 134.81,47.78 134.81,47.31 134.73,47.23 | 190.13,24.05 190.06,24.13 128.46,24.13 127.51,23.18 C47.+ | 190.13,24.05 191.01,23.18 C46.+ | C48.+ 260.86,23.18 259.91,24.13 190.21,24.13 190.13,24.05 | 128.3,74.77 128.3,187.8 129.1,188.59 ISP.4
  Bottom 0.305: C48.+ 261.18,22.23 261.18,14.45 EDGE.AA2 | C46.+ 191.33,22.23 191.33,14.45 EDGE.BA2 | EDGE.CA2 127.03,14.45 127.03,22.23 C47.+ 127.19,23.5 134.97,31.27 134.97,47.31 v135.13,47.78 | C1.1 145.76,57.78 144.81,56.83 144.81,53.02 v140.84,49.05 140.37,48.9 136.24,48.9 v135.13,47.78 | 134.97,58.42 127.67,58.42 123.22,53.98 C2.1 | 134.97,58.42 134.97,48.26 v135.13,47.78 | 134.97,58.42 134.97,72.39 136.87,74.3 C49.1

### Text on the board
Top: COPYRIGHT 1975 | CORPORATION | EDUCOMP | TSC8-75 | + | + | +